# EAGLE schematic ASIC_card (EAGLE 6.3)

## Sheet 1 of 4: Data and clock
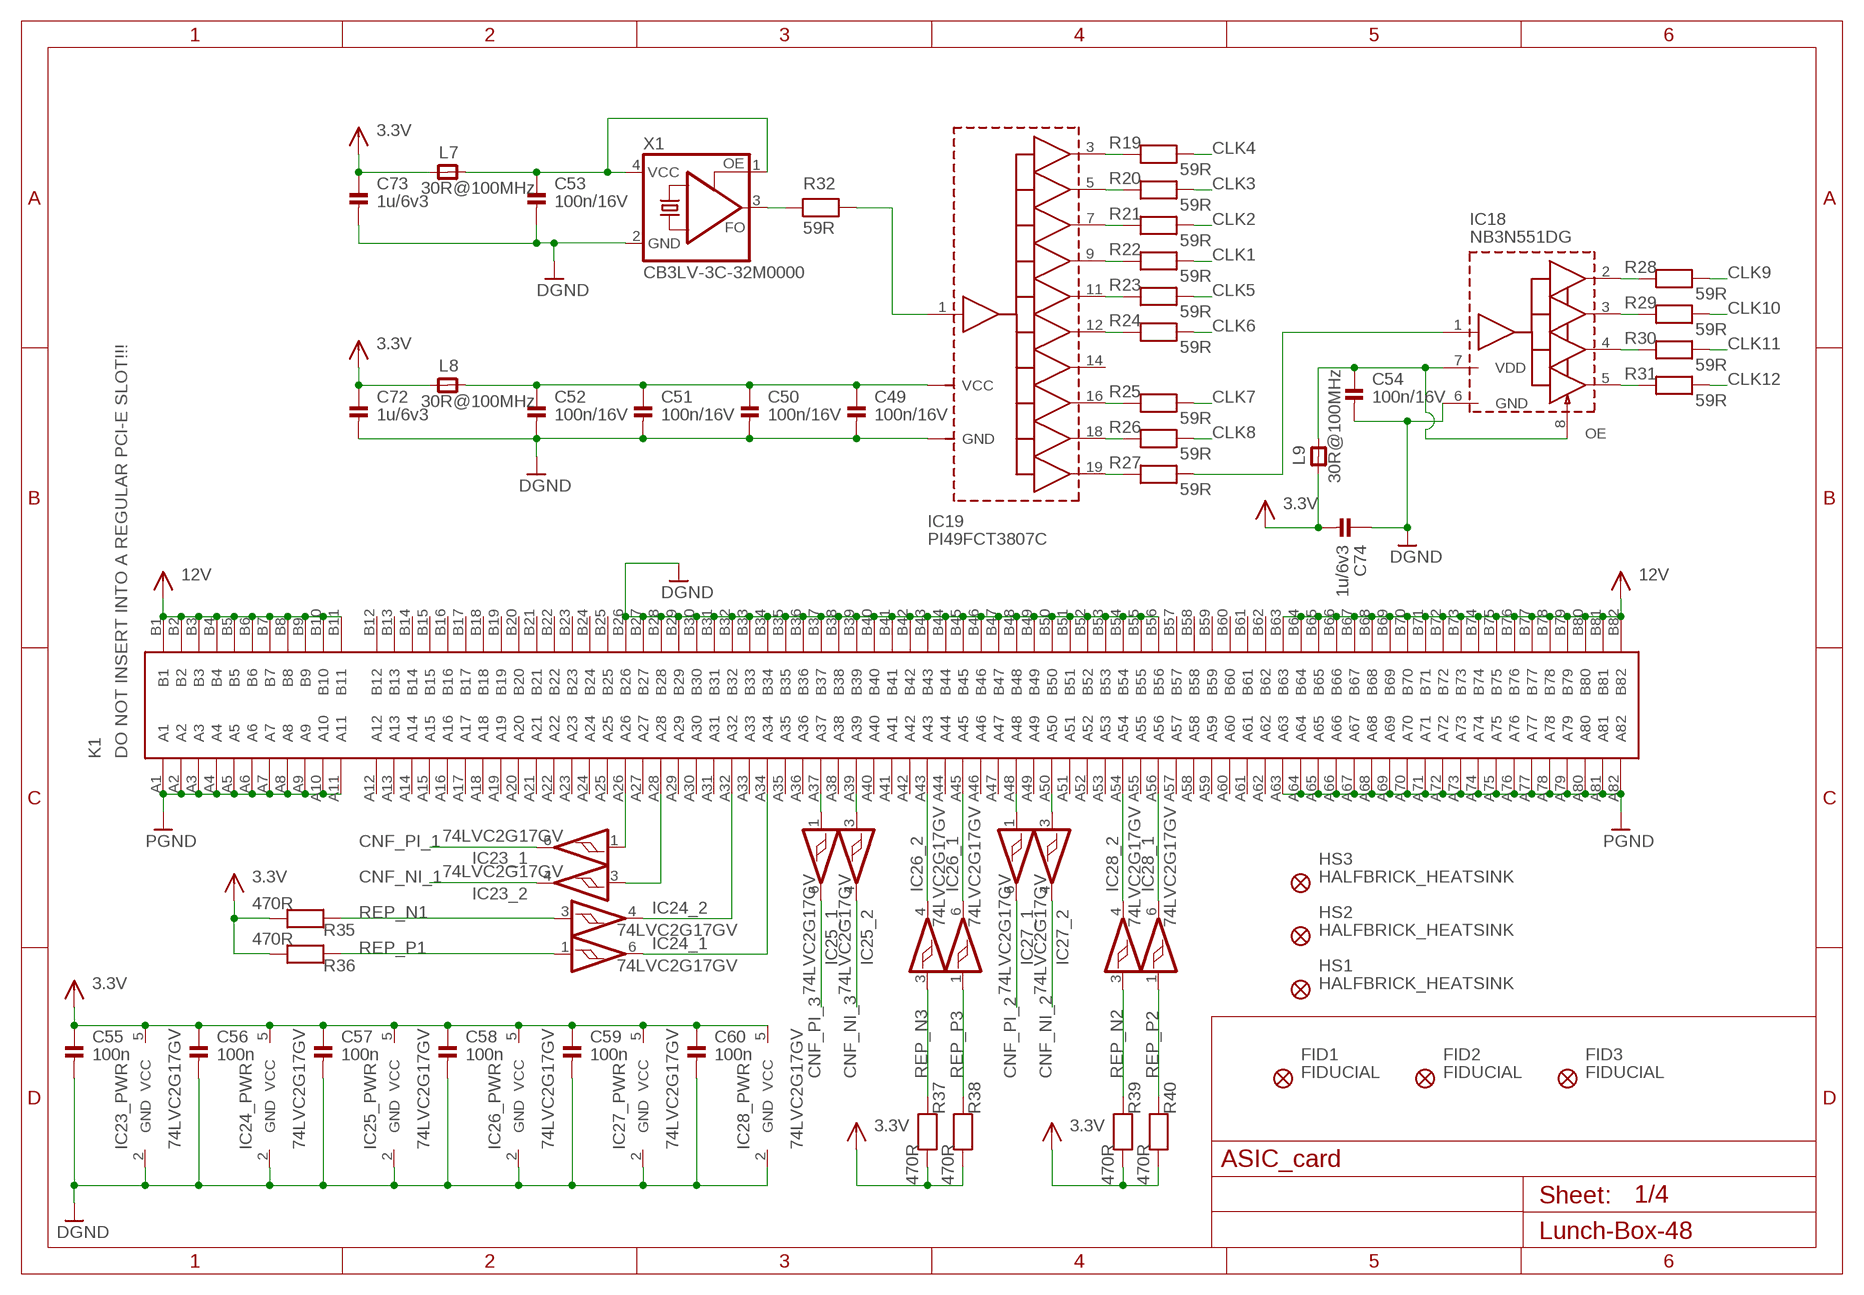
[diagram p0: schematic, sheet 1]

### Parts
C49  100n/16V  C0402  [0402]
C50  100n/16V  C0402  [0402]
C51  100n/16V  C0402  [0402]
C52  100n/16V  C0402  [0402]
C53  100n/16V  C0402  [0402]
C54  100n/16V  C0402  [0402]
C55  100n  C0603  [0603]
C56  100n  C0603  [0603]
C57  100n  C0603  [0603]
C58  100n  C0603  [0603]
C59  100n  C0603  [0603]
C60  100n  C0603  [0603]
C72  1u/6v3  C0402  [0402]
C73  1u/6v3  C0402  [0402]
C74  1u/6v3  C0402  [0402]
FID1  FIDUCIAL  [FID_1X2,5]
FID2  FIDUCIAL  [FID_1X2,5]
FID3  FIDUCIAL  [FID_1X2,5]
HS1  HALFBRICK_HEATSINK  [1/2_BRICK_HEATSINK]
HS2  HALFBRICK_HEATSINK  [1/2_BRICK_HEATSINK]
HS3  HALFBRICK_HEATSINK  [1/2_BRICK_HEATSINK]
IC18  NB3N551DG  [SO-8]
IC19  PI49FCT3807C  [SSOP-20]
IC23  74LVC2G17GV  [SOT23-6]
IC24  74LVC2G17GV  [SOT23-6]
IC25  74LVC2G17GV  [SOT23-6]
IC26  74LVC2G17GV  [SOT23-6]
IC27  74LVC2G17GV  [SOT23-6]
IC28  74LVC2G17GV  [SOT23-6]
K1  DO NOT INSERT INTO A REGULAR PCI-E SLOT!!!  PCI-E_CARDEDGE  [PCI-E_16X]
L7  30R@100MHz  FERRITE0603  [0603]
L8  30R@100MHz  FERRITE0603  [0603]
L9  30R@100MHz  FERRITE0603  [0603]
R19  59R  R0402  [0402]
R20  59R  R0402  [0402]
R21  59R  R0402  [0402]
R22  59R  R0402  [0402]
R23  59R  R0402  [0402]
R24  59R  R0402  [0402]
R25  59R  R0402  [0402]
R26  59R  R0402  [0402]
R27  59R  R0402  [0402]
R28  59R  R0402  [0402]
R29  59R  R0402  [0402]
R30  59R  R0402  [0402]
R31  59R  R0402  [0402]
R32  59R  R0402  [0402]
R35  470R  R0603  [0603]
R36  470R  R0603  [0603]
R37  470R  R0603  [0603]
R38  470R  R0603  [0603]
R39  470R  R0603  [0603]
R40  470R  R0603  [0603]
X1  CB3LV-3C-32M0000  [7X5_OSC]

### Nets
3.3V: C55.1 C56.1 C57.1 C58.1 C59.1 C60.1 C72.1 C73.1 C74.2 IC23.5(_PWR:VCC) IC24.5(_PWR:VCC) IC25.5(_PWR:VCC) IC26.5(_PWR:VCC) IC27.5(_PWR:VCC) IC28.5(_PWR:VCC) L7.1 L8.1 L9.1 R35.1 R36.1 R37.1 R38.1 R39.1 R40.1 ; also sheet 2,3,4
12V: K1.B1 K1.B2 K1.B3 K1.B4 K1.B5 K1.B6 K1.B7 K1.B8 K1.B9 K1.B10 K1.B11 K1.B63 K1.B64 K1.B65 K1.B66 K1.B67 K1.B68 K1.B69 K1.B70 K1.B71 K1.B72 K1.B73 K1.B74 K1.B75 K1.B76 K1.B77 K1.B78 K1.B79 K1.B80 K1.B81 K1.B82 ; also sheet 2
CLK1: R22.2 ; also sheet 3
CLK2: R21.2 ; also sheet 3
CLK3: R20.2 ; also sheet 3
CLK4: R19.2 ; also sheet 3
CLK5: R23.2 ; also sheet 3
CLK6: R24.2 ; also sheet 3
CLK7: R25.2 ; also sheet 3
CLK8: R26.2 ; also sheet 3
CLK9: R28.2 ; also sheet 3
CLK10: R29.2 ; also sheet 3
CLK11: R30.2 ; also sheet 3
CLK12: R31.2 ; also sheet 3
CNF_NI_1: IC23.4(_2:O) ; also sheet 3
CNF_NI_2: IC27.4(_2:O) ; also sheet 3
CNF_NI_3: IC25.4(_2:O) ; also sheet 3
CNF_PI_1: IC23.6(_1:O) ; also sheet 3
CNF_PI_2: IC27.6(_1:O) ; also sheet 3
CNF_PI_3: IC25.6(_1:O) ; also sheet 3
DGND: C49.2 C50.2 C51.2 C52.2 C53.2 C54.2 C55.2 C56.2 C57.2 C58.2 C59.2 C60.2 C72.2 C73.2 C74.1 IC18.6(GND) IC19.2(GND) IC19.6(GND) IC19.10(GND) IC19.13(GND) IC19.17(GND) IC23.2(_PWR:GND) IC24.2(_PWR:GND) IC25.2(_PWR:GND) IC26.2(_PWR:GND) IC27.2(_PWR:GND) IC28.2(_PWR:GND) K1.B26 K1.B27 K1.B28 K1.B29 K1.B30 K1.B31 K1.B32 K1.B33 K1.B34 K1.B35 K1.B36 K1.B37 K1.B38 K1.B39 K1.B40 K1.B41 K1.B42 K1.B43 K1.B44 K1.B45 K1.B46 K1.B47 K1.B48 K1.B49 K1.B50 K1.B51 K1.B52 K1.B53 K1.B54 K1.B55 K1.B56 X1.2(GND) ; also sheet 2,3,4
N$49: IC23.1(_1:I) K1.A26
N$50: IC23.3(_2:I) K1.A28
N$51: IC19.18(B8) R26.1
N$52: IC19.19(B9) R27.1
N$53: IC19.16(B7) R25.1
N$54: IC19.12(B5) R24.1
N$55: IC19.11(B4) R23.1
N$56: IC19.9(B3) R22.1
N$57: IC19.7(B2) R21.1
N$58: IC19.5(B1) R20.1
N$59: IC19.3(B0) R19.1
N$60: IC18.2(Q1) R28.1
N$61: IC18.3(Q2) R29.1
N$62: IC18.4(Q3) R30.1
N$63: IC18.5(Q4) R31.1
N$65: IC24.4(_2:O) K1.A32
N$66: IC24.6(_1:O) K1.A34
N$67: IC26.6(_1:O) K1.A45
N$68: R32.1 X1.3(FO)
N$69: IC19.1(A) R32.2
N$70: IC26.4(_2:O) K1.A43
N$71: IC28.4(_2:O) K1.A54
N$72: IC28.6(_1:O) K1.A56
N$73: IC27.1(_1:I) K1.A48
N$74: IC27.3(_2:I) K1.A50
N$75: C53.1 L7.2 X1.1(OE) X1.4(VCC)
N$76: C54.1 IC18.7(VDD) IC18.8(OE) L9.2
N$77: C49.1 C50.1 C51.1 C52.1 IC19.4(VCC) IC19.8(VCC) IC19.15(VCC) IC19.20(VCC) L8.2
N$78: IC18.1(CLK) R27.2
N$79: IC25.1(_1:I) K1.A37
N$80: IC25.3(_2:I) K1.A39
PGND: K1.A1 K1.A2 K1.A3 K1.A4 K1.A5 K1.A6 K1.A7 K1.A8 K1.A9 K1.A10 K1.A11 K1.A63 K1.A64 K1.A65 K1.A66 K1.A67 K1.A68 K1.A69 K1.A70 K1.A71 K1.A72 K1.A73 K1.A74 K1.A75 K1.A76 K1.A77 K1.A78 K1.A79 K1.A80 K1.A81 K1.A82 ; also sheet 2,3,4
REP_N1: IC24.3(_2:I) R35.2 ; also sheet 3
REP_N2: IC28.3(_2:I) R39.2 ; also sheet 3
REP_N3: IC26.3(_2:I) R37.2 ; also sheet 3
REP_P1: IC24.1(_1:I) R36.2 ; also sheet 3
REP_P2: IC28.1(_1:I) R40.2 ; also sheet 3
REP_P3: IC26.1(_1:I) R38.2 ; also sheet 3
Unconnected: IC19.14(B6) K1.A12 K1.A13 K1.A14 K1.A15 K1.A16 K1.A17 K1.A18 K1.A19 K1.A20 K1.A21 K1.A22 K1.A23 K1.A24 K1.A25 K1.A27 K1.A29 K1.A30 K1.A31 K1.A33 K1.A35 K1.A36 K1.A38 K1.A40 K1.A41 K1.A42 K1.A44 K1.A46 K1.A47 K1.A49 K1.A51 K1.A52 K1.A53 K1.A55 K1.A57 K1.A58 K1.A59 K1.A60 K1.A61 K1.A62 K1.B12 K1.B13 K1.B14 K1.B15 K1.B16 K1.B17 K1.B18 K1.B19 K1.B20 K1.B21 K1.B22 K1.B23 K1.B24 K1.B25 K1.B57 K1.B58 K1.B59 K1.B60 K1.B61 K1.B62

## Sheet 2 of 4: Powersuplies
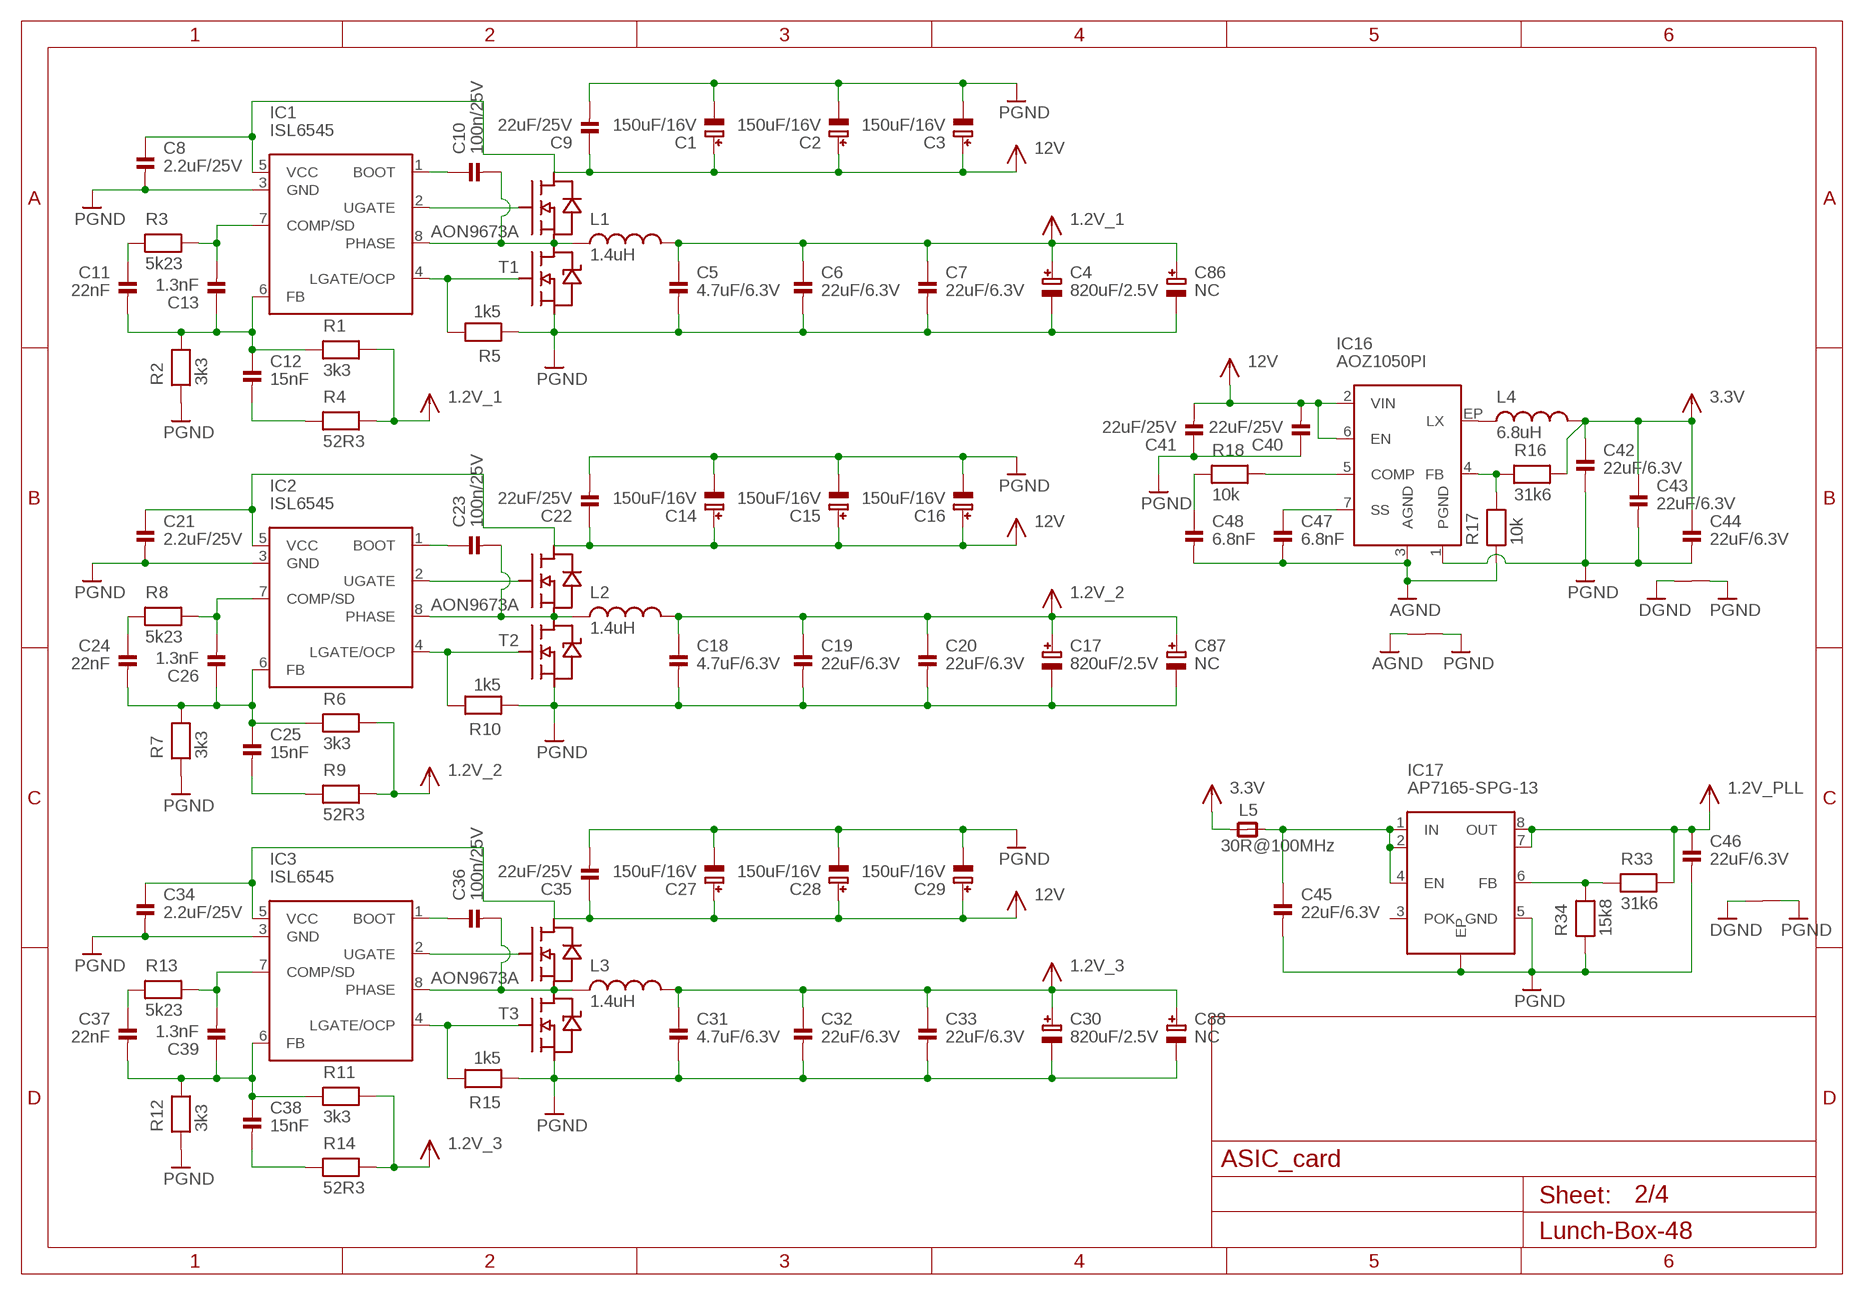
[diagram p1: schematic, sheet 2]

### Parts
C1  150uF/16V  C_POL  [CAP_POL_8MM]
C2  150uF/16V  C_POL  [CAP_POL_8MM]
C3  150uF/16V  C_POL  [CAP_POL_8MM]
C4  820uF/2.5V  C_POL  [CAP_POL_8MM]
C5  4.7uF/6.3V  C0306  [0306]
C6  22uF/6.3V  C0805  [0805]
C7  22uF/6.3V  C0805  [0805]
C8  2.2uF/25V  C0603  [0603]
C9  22uF/25V  C1210  [1210]
C10  100n/25V  C0603  [0603]
C11  22nF  C0603  [0603]
C12  15nF  C0603  [0603]
C13  1.3nF  C0603  [0603]
C14  150uF/16V  C_POL  [CAP_POL_8MM]
C15  150uF/16V  C_POL  [CAP_POL_8MM]
C16  150uF/16V  C_POL  [CAP_POL_8MM]
C17  820uF/2.5V  C_POL  [CAP_POL_8MM]
C18  4.7uF/6.3V  C0306  [0306]
C19  22uF/6.3V  C0805  [0805]
C20  22uF/6.3V  C0805  [0805]
C21  2.2uF/25V  C0603  [0603]
C22  22uF/25V  C1210  [1210]
C23  100n/25V  C0603  [0603]
C24  22nF  C0603  [0603]
C25  15nF  C0603  [0603]
C26  1.3nF  C0603  [0603]
C27  150uF/16V  C_POL  [CAP_POL_8MM]
C28  150uF/16V  C_POL  [CAP_POL_8MM]
C29  150uF/16V  C_POL  [CAP_POL_8MM]
C30  820uF/2.5V  C_POL  [CAP_POL_8MM]
C31  4.7uF/6.3V  C0306  [0306]
C32  22uF/6.3V  C0805  [0805]
C33  22uF/6.3V  C0805  [0805]
C34  2.2uF/25V  C0603  [0603]
C35  22uF/25V  C1210  [1210]
C36  100n/25V  C0603  [0603]
C37  22nF  C0603  [0603]
C38  15nF  C0603  [0603]
C39  1.3nF  C0603  [0603]
C40  22uF/25V  C1210  [1210]
C41  22uF/25V  C1210  [1210]
C42  22uF/6.3V  C0805  [0805]
C43  22uF/6.3V  C0805  [0805]
C44  22uF/6.3V  C0805  [0805]
C45  22uF/6.3V  C0805  [0805]
C46  22uF/6.3V  C0805  [0805]
C47  6.8nF  C0603  [0603]
C48  6.8nF  C0603  [0603]
C86  NC  C_POL  [CAP_POL_8MM]
C87  NC  C_POL  [CAP_POL_8MM]
C88  NC  C_POL  [CAP_POL_8MM]
IC1  ISL6545  [SO-8_BIGPADS]
IC2  ISL6545  [SO-8_BIGPADS]
IC3  ISL6545  [SO-8_BIGPADS]
IC16  AOZ1050PI  [SO-8_EP]
IC17  AP7165-SPG-13  [SO-8_EP]
L1  1.4uH  B82559A0142A013  [B82559A0142A013]
L2  1.4uH  B82559A0142A013  [B82559A0142A013]
L3  1.4uH  B82559A0142A013  [B82559A0142A013]
L4  6.8uH  SRU1048-6R8Y  [SRU1048-6R8Y]
L5  30R@100MHz  FERRITE0603  [0603]
R1  3k3  R0603  [0603]
R2  3k3  R0603  [0603]
R3  5k23  R0603  [0603]
R4  52R3  R0603  [0603]
R5  1k5  R0603  [0603]
R6  3k3  R0603  [0603]
R7  3k3  R0603  [0603]
R8  5k23  R0603  [0603]
R9  52R3  R0603  [0603]
R10  1k5  R0603  [0603]
R11  3k3  R0603  [0603]
R12  3k3  R0603  [0603]
R13  5k23  R0603  [0603]
R14  52R3  R0603  [0603]
R15  1k5  R0603  [0603]
R16  31k6  R0603  [0603]
R17  10k  R0603  [0603]
R18  10k  R0603  [0603]
R33  31k6  R0603  [0603]
R34  15k8  R0603  [0603]
T1  AON9673A  [DFN5X6]
T2  AON9673A  [DFN5X6]
T3  AON9673A  [DFN5X6]
VIA1  VIA  [VIA]
VIA2  VIA  [VIA]
VIA3  VIA  [VIA]

### Nets
1.2V_1: C4.P$1(+) C5.1 C6.1 C7.1 C86.P$1(+) L1.2 R1.2 R4.2 ; also sheet 3,4
1.2V_2: C17.P$1(+) C18.1 C19.1 C20.1 C87.P$1(+) L2.2 R6.2 R9.2 ; also sheet 3,4
1.2V_3: C30.P$1(+) C31.1 C32.1 C33.1 C88.P$1(+) L3.2 R11.2 R14.2 ; also sheet 3,4
1.2V_PLL: C46.1 IC17.7(OUT1) IC17.8(OUT) R33.2 ; also sheet 4
3.3V: C42.1 C43.1 C44.1 L4.2 L5.1 R16.2 ; also sheet 1,3,4
12V: C1.P$1(+) C2.P$1(+) C3.P$1(+) C8.1 C9.1 C14.P$1(+) C15.P$1(+) C16.P$1(+) C21.1 C22.1 C27.P$1(+) C28.P$1(+) C29.P$1(+) C34.1 C35.1 C40.2 C41.2 IC1.5(VCC) IC2.5(VCC) IC3.5(VCC) IC16.2(VIN) IC16.6(EN) T1.D1 T2.D1 T3.D1 ; also sheet 1
AGND: C47.2 C48.2 IC16.3(AGND) R17.1 VIA1.P$1
DGND: VIA2.P$1 VIA3.P$1 ; also sheet 1,3,4
N$7: C12.2 R4.1
N$8: IC1.2(UGATE) T1.1(G1)
N$9: IC1.4(LGATE/OCP) R5.2 T1.8(G2)
N$10: C10.1 IC1.1(BOOT)
N$11: C13.2 IC1.7(COMP/SD) R3.2
N$12: C11.1 R3.1
N$15: C11.2 C12.1 C13.1 IC1.6(FB) R1.1 R2.2
N$26: C10.2 IC1.8(PHASE) L1.1 T1.S1_D2
N$27: IC3.2(UGATE) T3.1(G1)
N$28: IC2.2(UGATE) T2.1(G1)
N$29: IC2.4(LGATE/OCP) R10.2 T2.8(G2)
N$30: C23.2 IC2.8(PHASE) L2.1 T2.S1_D2
N$31: C23.1 IC2.1(BOOT)
N$32: C26.2 IC2.7(COMP/SD) R8.2
N$33: C24.1 R8.1
N$34: C24.2 C25.1 C26.1 IC2.6(FB) R6.1 R7.2
N$35: C25.2 R9.1
N$36: IC3.4(LGATE/OCP) R15.2 T3.8(G2)
N$37: C36.2 IC3.8(PHASE) L3.1 T3.S1_D2
N$38: C36.1 IC3.1(BOOT)
N$39: C39.2 IC3.7(COMP/SD) R13.2
N$40: C37.1 R13.1
N$41: C37.2 C38.1 C39.1 IC3.6(FB) R11.1 R12.2
N$42: C38.2 R14.1
N$43: C47.1 IC16.7(SS)
N$44: C45.1 IC17.1(IN) IC17.2(IN1) IC17.4(EN) L5.2
N$45: C48.1 R18.1
N$46: IC16.5(COMP) R18.2
N$47: IC16.4(FB) R16.1 R17.2
N$48: IC16.EP(LX) L4.1
N$64: IC17.6(FB) R33.1 R34.2
PGND: C1.P$2(-) C2.P$2(-) C3.P$2(-) C4.P$2(-) C5.2 C6.2 C7.2 C8.2 C9.2 C14.P$2(-) C15.P$2(-) C16.P$2(-) C17.P$2(-) C18.2 C19.2 C20.2 C21.2 C22.2 C27.P$2(-) C28.P$2(-) C29.P$2(-) C30.P$2(-) C31.2 C32.2 C33.2 C34.2 C35.2 C40.1 C41.1 C42.2 C43.2 C44.2 C45.2 C46.2 C86.P$2(-) C87.P$2(-) C88.P$2(-) IC1.3(GND) IC2.3(GND) IC3.3(GND) IC16.1(PGND) IC17.5(GND) IC17.EP R2.1 R5.1 R7.1 R10.1 R12.1 R15.1 R34.1 T1.5(S2) T1.6(S2) T1.7(S2) T2.5(S2) T2.6(S2) T2.7(S2) T3.5(S2) T3.6(S2) T3.7(S2) VIA1.P$2 VIA2.P$2 VIA3.P$2 ; also sheet 1,3,4
Unconnected: IC17.3(POK)

## Sheet 3 of 4: ASICs
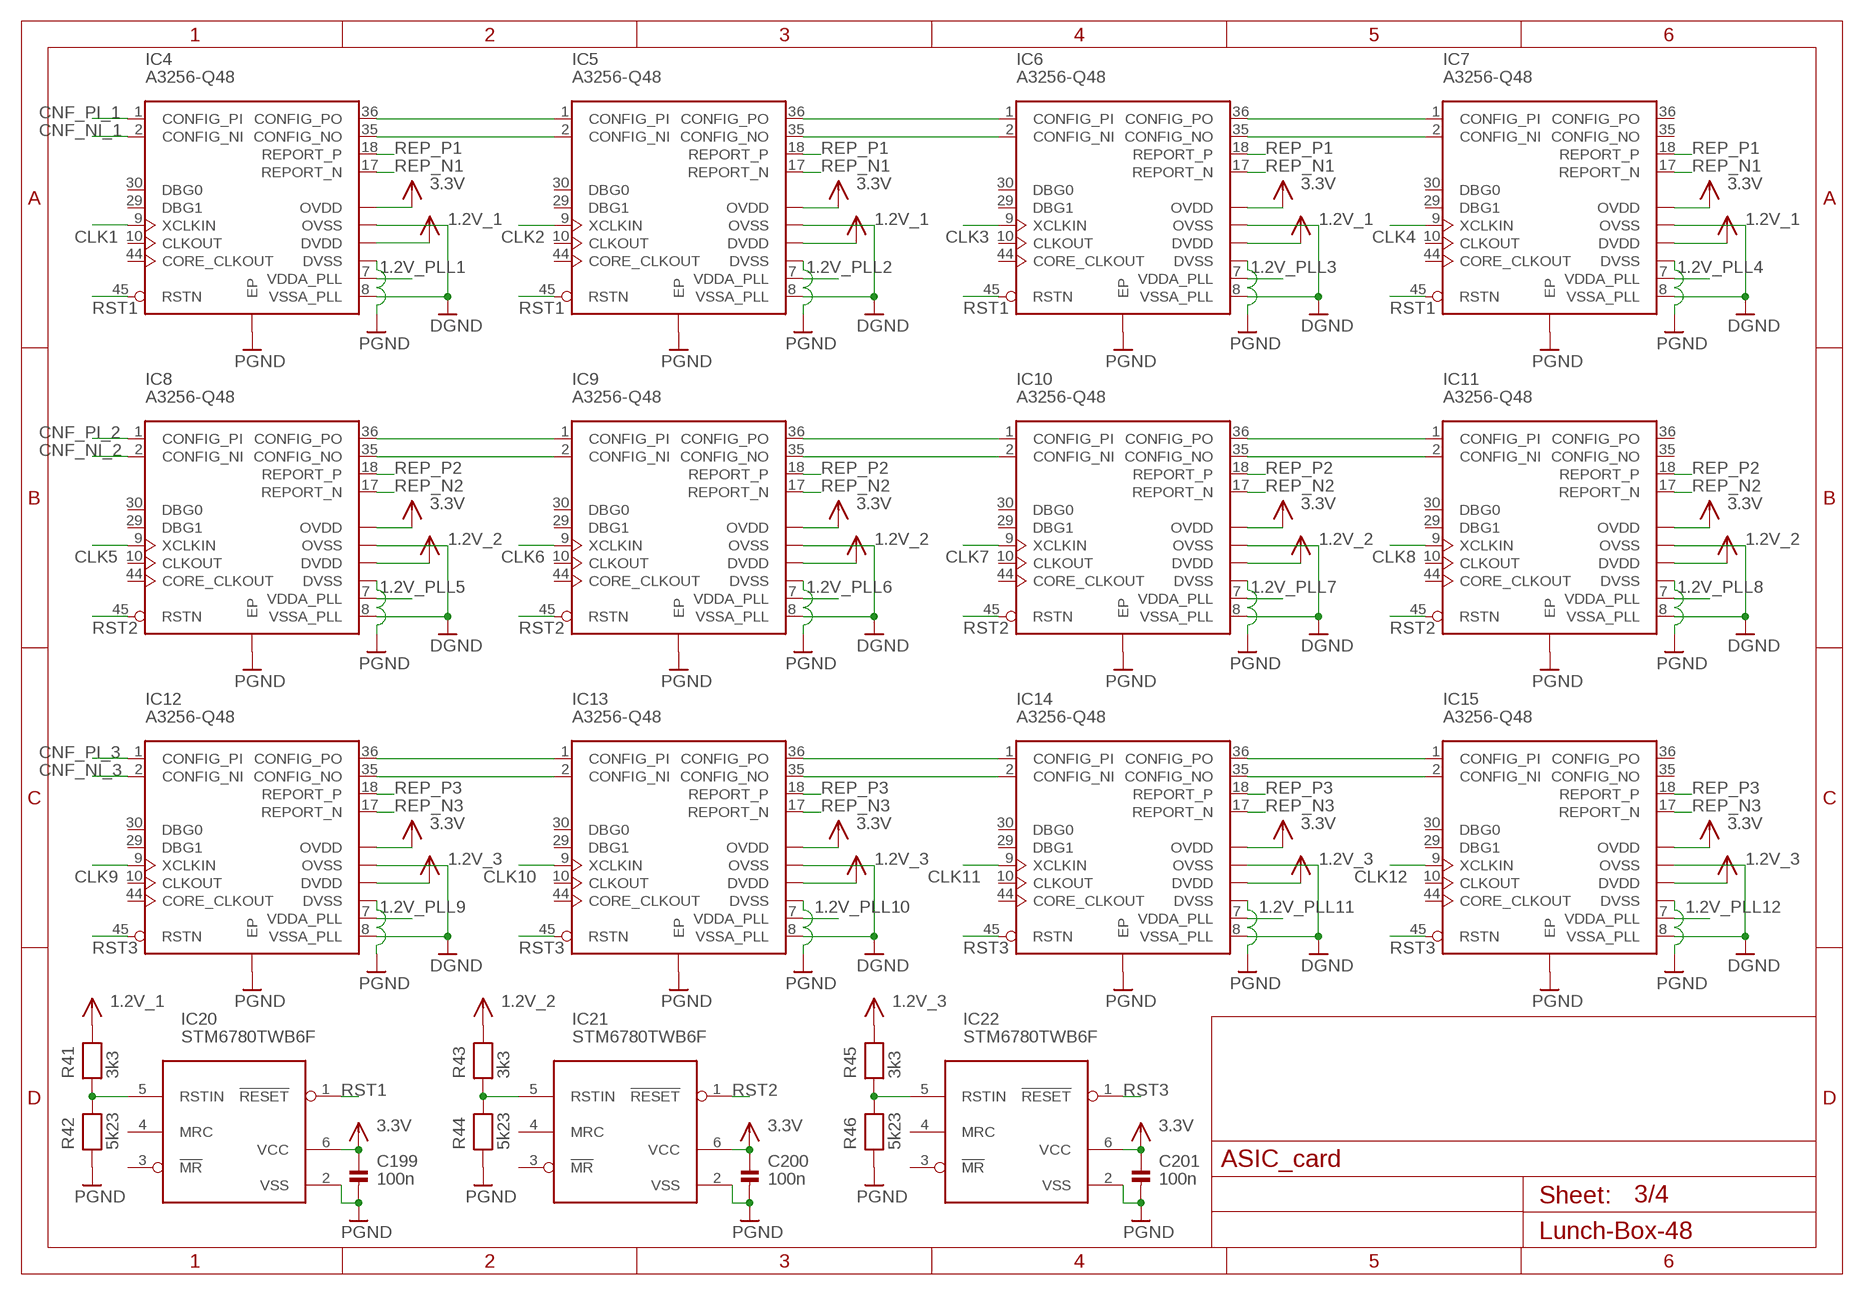
[diagram p2: schematic, sheet 3]

### Parts
C199  100n  C0603  [0603]
C200  100n  C0603  [0603]
C201  100n  C0603  [0603]
IC4  A3256-Q48  [QFN48_EP]
IC5  A3256-Q48  [QFN48_EP]
IC6  A3256-Q48  [QFN48_EP]
IC7  A3256-Q48  [QFN48_EP]
IC8  A3256-Q48  [QFN48_EP]
IC9  A3256-Q48  [QFN48_EP]
IC10  A3256-Q48  [QFN48_EP]
IC11  A3256-Q48  [QFN48_EP]
IC12  A3256-Q48  [QFN48_EP]
IC13  A3256-Q48  [QFN48_EP]
IC14  A3256-Q48  [QFN48_EP]
IC15  A3256-Q48  [QFN48_EP]
IC20  STM6780TWB6F  [SOT23-6]
IC21  STM6780TWB6F  [SOT23-6]
IC22  STM6780TWB6F  [SOT23-6]
R41  3k3  R0603  [0603]
R42  5k23  R0603  [0603]
R43  3k3  R0603  [0603]
R44  5k23  R0603  [0603]
R45  3k3  R0603  [0603]
R46  5k23  R0603  [0603]

### Nets
1.2V_1: IC4.3(DVDD) IC4.4(DVDD) IC4.6(DVDD) IC4.11(DVDD) IC4.12(DVDD) IC4.13(DVDD) IC4.14(DVDD) IC4.15(DVDD) IC4.16(DVDD) IC4.19(DVDD) IC4.21(DVDD) IC4.22(DVDD) IC4.25(DVDD) IC4.26(DVDD) IC4.27(DVDD) IC4.28(DVDD) IC4.31(DVDD) IC4.33(DVDD) IC4.34(DVDD) IC4.39(DVDD) IC4.40(DVDD) IC4.41(DVDD) IC4.43(DVDD) IC4.46(DVDD) IC4.47(DVDD) IC4.48(DVDD) IC5.3(DVDD) IC5.4(DVDD) IC5.6(DVDD) IC5.11(DVDD) IC5.12(DVDD) IC5.13(DVDD) IC5.14(DVDD) IC5.15(DVDD) IC5.16(DVDD) IC5.19(DVDD) IC5.21(DVDD) IC5.22(DVDD) IC5.25(DVDD) IC5.26(DVDD) IC5.27(DVDD) IC5.28(DVDD) IC5.31(DVDD) IC5.33(DVDD) IC5.34(DVDD) IC5.39(DVDD) IC5.40(DVDD) IC5.41(DVDD) IC5.43(DVDD) IC5.46(DVDD) IC5.47(DVDD) IC5.48(DVDD) IC6.3(DVDD) IC6.4(DVDD) IC6.6(DVDD) IC6.11(DVDD) IC6.12(DVDD) IC6.13(DVDD) IC6.14(DVDD) IC6.15(DVDD) IC6.16(DVDD) IC6.19(DVDD) IC6.21(DVDD) IC6.22(DVDD) IC6.25(DVDD) IC6.26(DVDD) IC6.27(DVDD) IC6.28(DVDD) IC6.31(DVDD) IC6.33(DVDD) IC6.34(DVDD) IC6.39(DVDD) IC6.40(DVDD) IC6.41(DVDD) IC6.43(DVDD) IC6.46(DVDD) IC6.47(DVDD) IC6.48(DVDD) IC7.3(DVDD) IC7.4(DVDD) IC7.6(DVDD) IC7.11(DVDD) IC7.12(DVDD) IC7.13(DVDD) IC7.14(DVDD) IC7.15(DVDD) IC7.16(DVDD) IC7.19(DVDD) IC7.21(DVDD) IC7.22(DVDD) IC7.25(DVDD) IC7.26(DVDD) IC7.27(DVDD) IC7.28(DVDD) IC7.31(DVDD) IC7.33(DVDD) IC7.34(DVDD) IC7.39(DVDD) IC7.40(DVDD) IC7.41(DVDD) IC7.43(DVDD) IC7.46(DVDD) IC7.47(DVDD) IC7.48(DVDD) R41.2 ; also sheet 2,4
1.2V_2: IC8.3(DVDD) IC8.4(DVDD) IC8.6(DVDD) IC8.11(DVDD) IC8.12(DVDD) IC8.13(DVDD) IC8.14(DVDD) IC8.15(DVDD) IC8.16(DVDD) IC8.19(DVDD) IC8.21(DVDD) IC8.22(DVDD) IC8.25(DVDD) IC8.26(DVDD) IC8.27(DVDD) IC8.28(DVDD) IC8.31(DVDD) IC8.33(DVDD) IC8.34(DVDD) IC8.39(DVDD) IC8.40(DVDD) IC8.41(DVDD) IC8.43(DVDD) IC8.46(DVDD) IC8.47(DVDD) IC8.48(DVDD) IC9.3(DVDD) IC9.4(DVDD) IC9.6(DVDD) IC9.11(DVDD) IC9.12(DVDD) IC9.13(DVDD) IC9.14(DVDD) IC9.15(DVDD) IC9.16(DVDD) IC9.19(DVDD) IC9.21(DVDD) IC9.22(DVDD) IC9.25(DVDD) IC9.26(DVDD) IC9.27(DVDD) IC9.28(DVDD) IC9.31(DVDD) IC9.33(DVDD) IC9.34(DVDD) IC9.39(DVDD) IC9.40(DVDD) IC9.41(DVDD) IC9.43(DVDD) IC9.46(DVDD) IC9.47(DVDD) IC9.48(DVDD) IC10.3(DVDD) IC10.4(DVDD) IC10.6(DVDD) IC10.11(DVDD) IC10.12(DVDD) IC10.13(DVDD) IC10.14(DVDD) IC10.15(DVDD) IC10.16(DVDD) IC10.19(DVDD) IC10.21(DVDD) IC10.22(DVDD) IC10.25(DVDD) IC10.26(DVDD) IC10.27(DVDD) IC10.28(DVDD) IC10.31(DVDD) IC10.33(DVDD) IC10.34(DVDD) IC10.39(DVDD) IC10.40(DVDD) IC10.41(DVDD) IC10.43(DVDD) IC10.46(DVDD) IC10.47(DVDD) IC10.48(DVDD) IC11.3(DVDD) IC11.4(DVDD) IC11.6(DVDD) IC11.11(DVDD) IC11.12(DVDD) IC11.13(DVDD) IC11.14(DVDD) IC11.15(DVDD) IC11.16(DVDD) IC11.19(DVDD) IC11.21(DVDD) IC11.22(DVDD) IC11.25(DVDD) IC11.26(DVDD) IC11.27(DVDD) IC11.28(DVDD) IC11.31(DVDD) IC11.33(DVDD) IC11.34(DVDD) IC11.39(DVDD) IC11.40(DVDD) IC11.41(DVDD) IC11.43(DVDD) IC11.46(DVDD) IC11.47(DVDD) IC11.48(DVDD) R43.2 ; also sheet 2,4
1.2V_3: IC12.3(DVDD) IC12.4(DVDD) IC12.6(DVDD) IC12.11(DVDD) IC12.12(DVDD) IC12.13(DVDD) IC12.14(DVDD) IC12.15(DVDD) IC12.16(DVDD) IC12.19(DVDD) IC12.21(DVDD) IC12.22(DVDD) IC12.25(DVDD) IC12.26(DVDD) IC12.27(DVDD) IC12.28(DVDD) IC12.31(DVDD) IC12.33(DVDD) IC12.34(DVDD) IC12.39(DVDD) IC12.40(DVDD) IC12.41(DVDD) IC12.43(DVDD) IC12.46(DVDD) IC12.47(DVDD) IC12.48(DVDD) IC13.3(DVDD) IC13.4(DVDD) IC13.6(DVDD) IC13.11(DVDD) IC13.12(DVDD) IC13.13(DVDD) IC13.14(DVDD) IC13.15(DVDD) IC13.16(DVDD) IC13.19(DVDD) IC13.21(DVDD) IC13.22(DVDD) IC13.25(DVDD) IC13.26(DVDD) IC13.27(DVDD) IC13.28(DVDD) IC13.31(DVDD) IC13.33(DVDD) IC13.34(DVDD) IC13.39(DVDD) IC13.40(DVDD) IC13.41(DVDD) IC13.43(DVDD) IC13.46(DVDD) IC13.47(DVDD) IC13.48(DVDD) IC14.3(DVDD) IC14.4(DVDD) IC14.6(DVDD) IC14.11(DVDD) IC14.12(DVDD) IC14.13(DVDD) IC14.14(DVDD) IC14.15(DVDD) IC14.16(DVDD) IC14.19(DVDD) IC14.21(DVDD) IC14.22(DVDD) IC14.25(DVDD) IC14.26(DVDD) IC14.27(DVDD) IC14.28(DVDD) IC14.31(DVDD) IC14.33(DVDD) IC14.34(DVDD) IC14.39(DVDD) IC14.40(DVDD) IC14.41(DVDD) IC14.43(DVDD) IC14.46(DVDD) IC14.47(DVDD) IC14.48(DVDD) IC15.3(DVDD) IC15.4(DVDD) IC15.6(DVDD) IC15.11(DVDD) IC15.12(DVDD) IC15.13(DVDD) IC15.14(DVDD) IC15.15(DVDD) IC15.16(DVDD) IC15.19(DVDD) IC15.21(DVDD) IC15.22(DVDD) IC15.25(DVDD) IC15.26(DVDD) IC15.27(DVDD) IC15.28(DVDD) IC15.31(DVDD) IC15.33(DVDD) IC15.34(DVDD) IC15.39(DVDD) IC15.40(DVDD) IC15.41(DVDD) IC15.43(DVDD) IC15.46(DVDD) IC15.47(DVDD) IC15.48(DVDD) R45.2 ; also sheet 2,4
1.2V_PLL1: IC4.7(VDDA_PLL) ; also sheet 4
1.2V_PLL2: IC5.7(VDDA_PLL) ; also sheet 4
1.2V_PLL3: IC6.7(VDDA_PLL) ; also sheet 4
1.2V_PLL4: IC7.7(VDDA_PLL) ; also sheet 4
1.2V_PLL5: IC8.7(VDDA_PLL) ; also sheet 4
1.2V_PLL6: IC9.7(VDDA_PLL) ; also sheet 4
1.2V_PLL7: IC10.7(VDDA_PLL) ; also sheet 4
1.2V_PLL8: IC11.7(VDDA_PLL) ; also sheet 4
1.2V_PLL9: IC12.7(VDDA_PLL) ; also sheet 4
1.2V_PLL10: IC13.7(VDDA_PLL) ; also sheet 4
1.2V_PLL11: IC14.7(VDDA_PLL) ; also sheet 4
1.2V_PLL12: IC15.7(VDDA_PLL) ; also sheet 4
3.3V: C199.1 C200.1 C201.1 IC4.24(OVDD) IC4.37(OVDD) IC5.24(OVDD) IC5.37(OVDD) IC6.24(OVDD) IC6.37(OVDD) IC7.24(OVDD) IC7.37(OVDD) IC8.24(OVDD) IC8.37(OVDD) IC9.24(OVDD) IC9.37(OVDD) IC10.24(OVDD) IC10.37(OVDD) IC11.24(OVDD) IC11.37(OVDD) IC12.24(OVDD) IC12.37(OVDD) IC13.24(OVDD) IC13.37(OVDD) IC14.24(OVDD) IC14.37(OVDD) IC15.24(OVDD) IC15.37(OVDD) IC20.6(VCC) IC21.6(VCC) IC22.6(VCC) ; also sheet 1,2,4
CLK1: IC4.9(XCLKIN) ; also sheet 1
CLK2: IC5.9(XCLKIN) ; also sheet 1
CLK3: IC6.9(XCLKIN) ; also sheet 1
CLK4: IC7.9(XCLKIN) ; also sheet 1
CLK5: IC8.9(XCLKIN) ; also sheet 1
CLK6: IC9.9(XCLKIN) ; also sheet 1
CLK7: IC10.9(XCLKIN) ; also sheet 1
CLK8: IC11.9(XCLKIN) ; also sheet 1
CLK9: IC12.9(XCLKIN) ; also sheet 1
CLK10: IC13.9(XCLKIN) ; also sheet 1
CLK11: IC14.9(XCLKIN) ; also sheet 1
CLK12: IC15.9(XCLKIN) ; also sheet 1
CNF_NI_1: IC4.2(CONFIG_NI) ; also sheet 1
CNF_NI_2: IC8.2(CONFIG_NI) ; also sheet 1
CNF_NI_3: IC12.2(CONFIG_NI) ; also sheet 1
CNF_PI_1: IC4.1(CONFIG_PI) ; also sheet 1
CNF_PI_2: IC8.1(CONFIG_PI) ; also sheet 1
CNF_PI_3: IC12.1(CONFIG_PI) ; also sheet 1
DGND: IC4.8(VSSA_PLL) IC4.23(OVSS) IC4.38(OVSS) IC5.8(VSSA_PLL) IC5.23(OVSS) IC5.38(OVSS) IC6.8(VSSA_PLL) IC6.23(OVSS) IC6.38(OVSS) IC7.8(VSSA_PLL) IC7.23(OVSS) IC7.38(OVSS) IC8.8(VSSA_PLL) IC8.23(OVSS) IC8.38(OVSS) IC9.8(VSSA_PLL) IC9.23(OVSS) IC9.38(OVSS) IC10.8(VSSA_PLL) IC10.23(OVSS) IC10.38(OVSS) IC11.8(VSSA_PLL) IC11.23(OVSS) IC11.38(OVSS) IC12.8(VSSA_PLL) IC12.23(OVSS) IC12.38(OVSS) IC13.8(VSSA_PLL) IC13.23(OVSS) IC13.38(OVSS) IC14.8(VSSA_PLL) IC14.23(OVSS) IC14.38(OVSS) IC15.8(VSSA_PLL) IC15.23(OVSS) IC15.38(OVSS) ; also sheet 1,2,4
N$1: IC4.36(CONFIG_PO) IC5.1(CONFIG_PI)
N$2: IC4.35(CONFIG_NO) IC5.2(CONFIG_NI)
N$3: IC5.36(CONFIG_PO) IC6.1(CONFIG_PI)
N$4: IC5.35(CONFIG_NO) IC6.2(CONFIG_NI)
N$5: IC6.36(CONFIG_PO) IC7.1(CONFIG_PI)
N$6: IC6.35(CONFIG_NO) IC7.2(CONFIG_NI)
N$13: IC8.36(CONFIG_PO) IC9.1(CONFIG_PI)
N$14: IC8.35(CONFIG_NO) IC9.2(CONFIG_NI)
N$16: IC9.36(CONFIG_PO) IC10.1(CONFIG_PI)
N$17: IC9.35(CONFIG_NO) IC10.2(CONFIG_NI)
N$18: IC10.36(CONFIG_PO) IC11.1(CONFIG_PI)
N$19: IC10.35(CONFIG_NO) IC11.2(CONFIG_NI)
N$20: IC14.36(CONFIG_PO) IC15.1(CONFIG_PI)
N$21: IC14.35(CONFIG_NO) IC15.2(CONFIG_NI)
N$22: IC13.36(CONFIG_PO) IC14.1(CONFIG_PI)
N$23: IC13.35(CONFIG_NO) IC14.2(CONFIG_NI)
N$24: IC12.36(CONFIG_PO) IC13.1(CONFIG_PI)
N$25: IC12.35(CONFIG_NO) IC13.2(CONFIG_NI)
N$81: IC20.5(RSTIN) R41.1 R42.2
N$82: IC21.5(RSTIN) R43.1 R44.2
N$85: IC22.5(RSTIN) R45.1 R46.2
PGND: C199.2 C200.2 C201.2 IC4.5(DVSS) IC4.20(DVSS) IC4.32(DVSS) IC4.42(DVSS) IC4.EP IC5.5(DVSS) IC5.20(DVSS) IC5.32(DVSS) IC5.42(DVSS) IC5.EP IC6.5(DVSS) IC6.20(DVSS) IC6.32(DVSS) IC6.42(DVSS) IC6.EP IC7.5(DVSS) IC7.20(DVSS) IC7.32(DVSS) IC7.42(DVSS) IC7.EP IC8.5(DVSS) IC8.20(DVSS) IC8.32(DVSS) IC8.42(DVSS) IC8.EP IC9.5(DVSS) IC9.20(DVSS) IC9.32(DVSS) IC9.42(DVSS) IC9.EP IC10.5(DVSS) IC10.20(DVSS) IC10.32(DVSS) IC10.42(DVSS) IC10.EP IC11.5(DVSS) IC11.20(DVSS) IC11.32(DVSS) IC11.42(DVSS) IC11.EP IC12.5(DVSS) IC12.20(DVSS) IC12.32(DVSS) IC12.42(DVSS) IC12.EP IC13.5(DVSS) IC13.20(DVSS) IC13.32(DVSS) IC13.42(DVSS) IC13.EP IC14.5(DVSS) IC14.20(DVSS) IC14.32(DVSS) IC14.42(DVSS) IC14.EP IC15.5(DVSS) IC15.20(DVSS) IC15.32(DVSS) IC15.42(DVSS) IC15.EP IC20.2(VSS) IC21.2(VSS) IC22.2(VSS) R42.1 R44.1 R46.1 ; also sheet 1,2,4
REP_N1: IC4.17(REPORT_N) IC5.17(REPORT_N) IC6.17(REPORT_N) IC7.17(REPORT_N) ; also sheet 1
REP_N2: IC8.17(REPORT_N) IC9.17(REPORT_N) IC10.17(REPORT_N) IC11.17(REPORT_N) ; also sheet 1
REP_N3: IC12.17(REPORT_N) IC13.17(REPORT_N) IC14.17(REPORT_N) IC15.17(REPORT_N) ; also sheet 1
REP_P1: IC4.18(REPORT_P) IC5.18(REPORT_P) IC6.18(REPORT_P) IC7.18(REPORT_P) ; also sheet 1
REP_P2: IC8.18(REPORT_P) IC9.18(REPORT_P) IC10.18(REPORT_P) IC11.18(REPORT_P) ; also sheet 1
REP_P3: IC12.18(REPORT_P) IC13.18(REPORT_P) IC14.18(REPORT_P) IC15.18(REPORT_P) ; also sheet 1
RST1: IC4.45(RSTN) IC5.45(RSTN) IC6.45(RSTN) IC7.45(RSTN) IC20.1(!RESET!)
RST2: IC8.45(RSTN) IC9.45(RSTN) IC10.45(RSTN) IC11.45(RSTN) IC21.1(!RESET!)
RST3: IC12.45(RSTN) IC13.45(RSTN) IC14.45(RSTN) IC15.45(RSTN) IC22.1(!RESET!)
Unconnected: IC4.10(CLKOUT) IC4.29(DBG1) IC4.30(DBG0) IC4.44(CORE_CLKOUT) IC5.10(CLKOUT) IC5.29(DBG1) IC5.30(DBG0) IC5.44(CORE_CLKOUT) IC6.10(CLKOUT) IC6.29(DBG1) IC6.30(DBG0) IC6.44(CORE_CLKOUT) IC7.10(CLKOUT) IC7.29(DBG1) IC7.30(DBG0) IC7.35(CONFIG_NO) IC7.36(CONFIG_PO) IC7.44(CORE_CLKOUT) IC8.10(CLKOUT) IC8.29(DBG1) IC8.30(DBG0) IC8.44(CORE_CLKOUT) IC9.10(CLKOUT) IC9.29(DBG1) IC9.30(DBG0) IC9.44(CORE_CLKOUT) IC10.10(CLKOUT) IC10.29(DBG1) IC10.30(DBG0) IC10.44(CORE_CLKOUT) IC11.10(CLKOUT) IC11.29(DBG1) IC11.30(DBG0) IC11.35(CONFIG_NO) IC11.36(CONFIG_PO) IC11.44(CORE_CLKOUT) IC12.10(CLKOUT) IC12.29(DBG1) IC12.30(DBG0) IC12.44(CORE_CLKOUT) IC13.10(CLKOUT) IC13.29(DBG1) IC13.30(DBG0) IC13.44(CORE_CLKOUT) IC14.10(CLKOUT) IC14.29(DBG1) IC14.30(DBG0) IC14.44(CORE_CLKOUT) IC15.10(CLKOUT) IC15.29(DBG1) IC15.30(DBG0) IC15.35(CONFIG_NO) IC15.36(CONFIG_PO) IC15.44(CORE_CLKOUT) IC20.3(!MR!) IC20.4(MRC) IC21.3(!MR!) IC21.4(MRC) IC22.3(!MR!) IC22.4(MRC)

## Sheet 4 of 4: ASIC decoupling
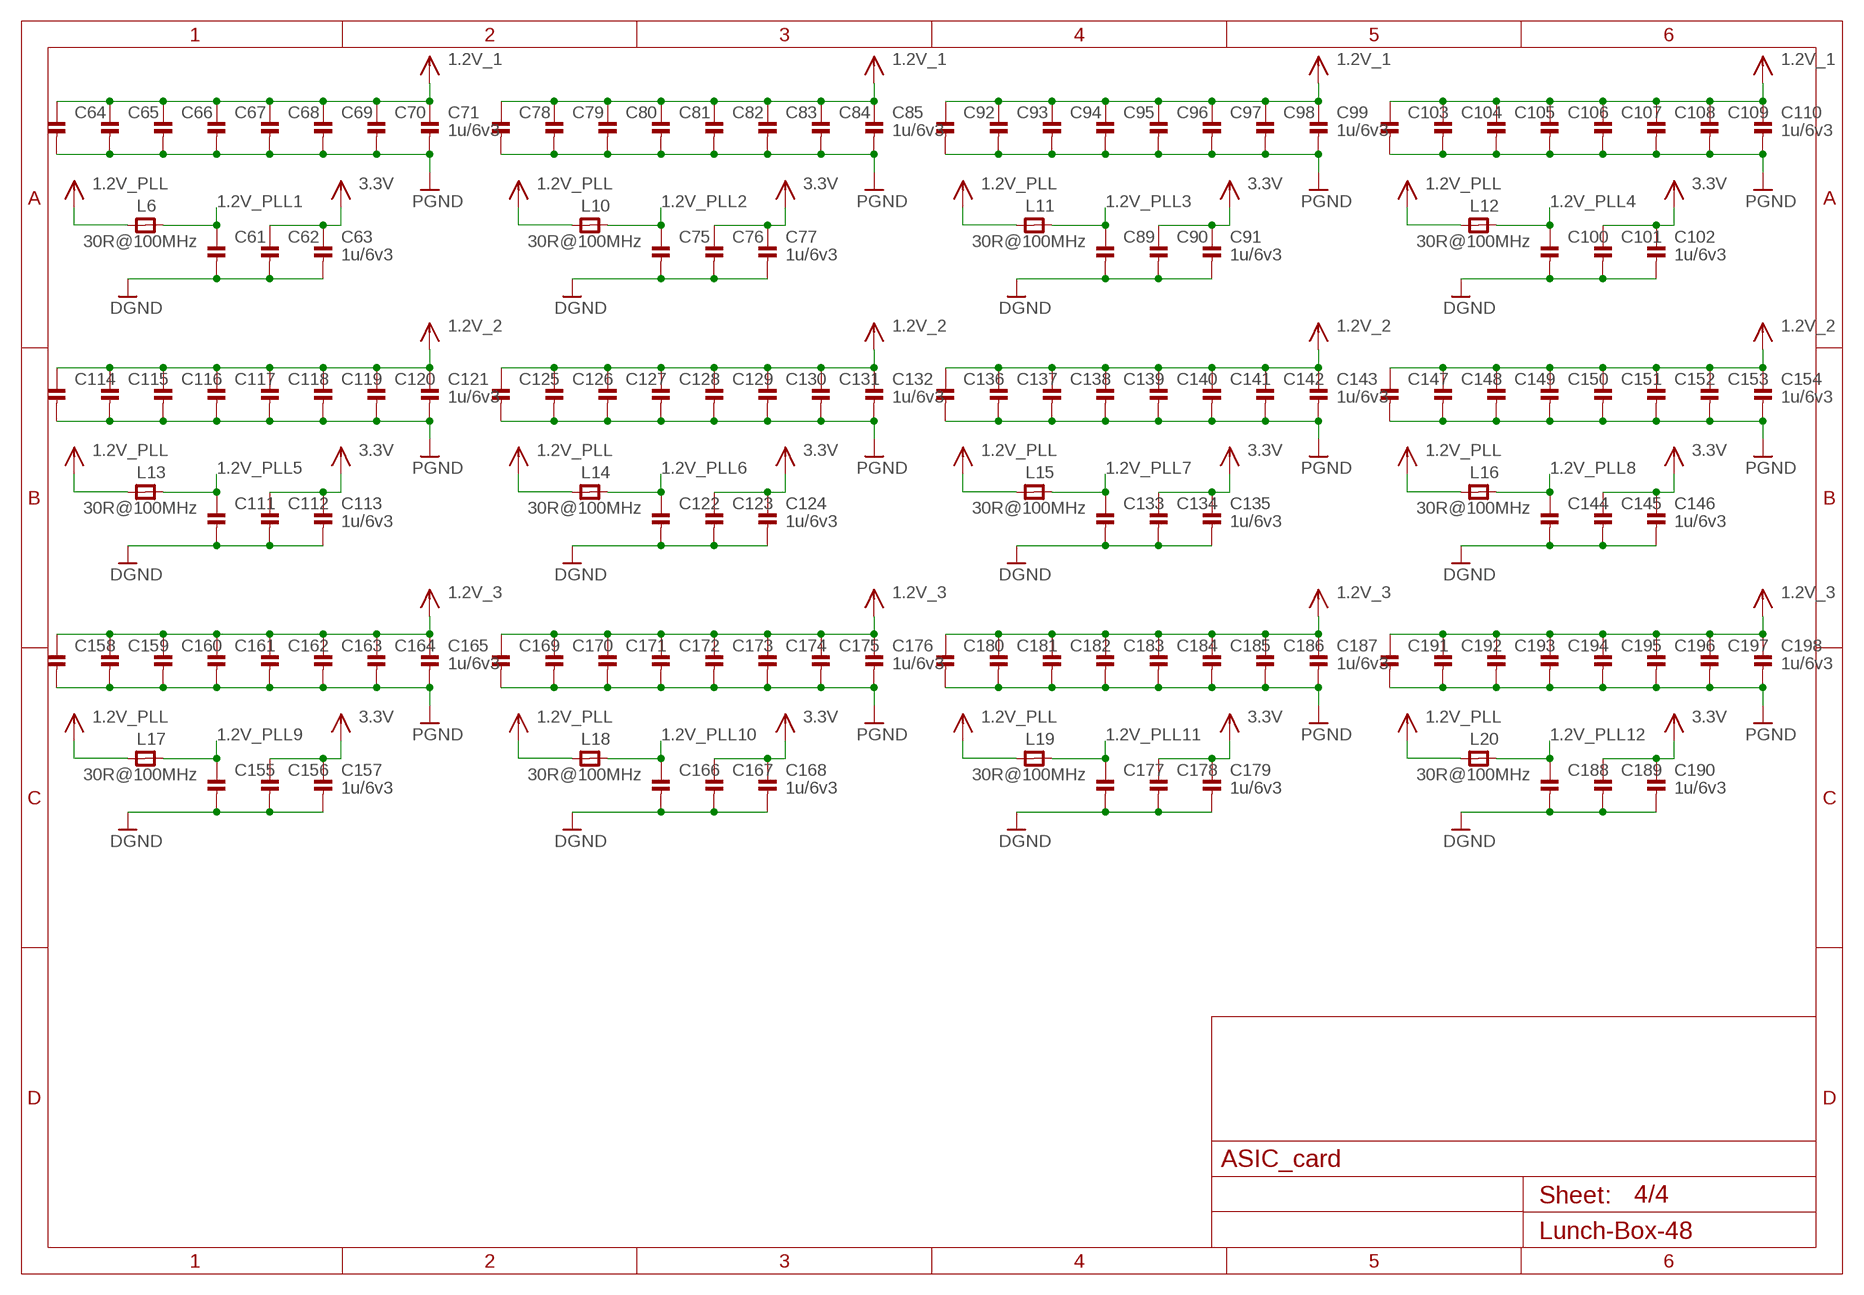
[diagram p3: schematic, sheet 4]

### Parts
C61  1u/6v3  C0402  [0402]
C62  1u/6v3  C0402  [0402]
C63  1u/6v3  C0402  [0402]
C64  1u/6v3  C0402  [0402]
C65  1u/6v3  C0402  [0402]
C66  1u/6v3  C0402  [0402]
C67  1u/6v3  C0402  [0402]
C68  1u/6v3  C0402  [0402]
C69  1u/6v3  C0402  [0402]
C70  1u/6v3  C0402  [0402]
C71  1u/6v3  C0402  [0402]
C75  1u/6v3  C0402  [0402]
C76  1u/6v3  C0402  [0402]
C77  1u/6v3  C0402  [0402]
C78  1u/6v3  C0402  [0402]
C79  1u/6v3  C0402  [0402]
C80  1u/6v3  C0402  [0402]
C81  1u/6v3  C0402  [0402]
C82  1u/6v3  C0402  [0402]
C83  1u/6v3  C0402  [0402]
C84  1u/6v3  C0402  [0402]
C85  1u/6v3  C0402  [0402]
C89  1u/6v3  C0402  [0402]
C90  1u/6v3  C0402  [0402]
C91  1u/6v3  C0402  [0402]
C92  1u/6v3  C0402  [0402]
C93  1u/6v3  C0402  [0402]
C94  1u/6v3  C0402  [0402]
C95  1u/6v3  C0402  [0402]
C96  1u/6v3  C0402  [0402]
C97  1u/6v3  C0402  [0402]
C98  1u/6v3  C0402  [0402]
C99  1u/6v3  C0402  [0402]
C100  1u/6v3  C0402  [0402]
C101  1u/6v3  C0402  [0402]
C102  1u/6v3  C0402  [0402]
C103  1u/6v3  C0402  [0402]
C104  1u/6v3  C0402  [0402]
C105  1u/6v3  C0402  [0402]
C106  1u/6v3  C0402  [0402]
C107  1u/6v3  C0402  [0402]
C108  1u/6v3  C0402  [0402]
C109  1u/6v3  C0402  [0402]
C110  1u/6v3  C0402  [0402]
C111  1u/6v3  C0402  [0402]
C112  1u/6v3  C0402  [0402]
C113  1u/6v3  C0402  [0402]
C114  1u/6v3  C0402  [0402]
C115  1u/6v3  C0402  [0402]
C116  1u/6v3  C0402  [0402]
C117  1u/6v3  C0402  [0402]
C118  1u/6v3  C0402  [0402]
C119  1u/6v3  C0402  [0402]
C120  1u/6v3  C0402  [0402]
C121  1u/6v3  C0402  [0402]
C122  1u/6v3  C0402  [0402]
C123  1u/6v3  C0402  [0402]
C124  1u/6v3  C0402  [0402]
C125  1u/6v3  C0402  [0402]
C126  1u/6v3  C0402  [0402]
C127  1u/6v3  C0402  [0402]
C128  1u/6v3  C0402  [0402]
C129  1u/6v3  C0402  [0402]
C130  1u/6v3  C0402  [0402]
C131  1u/6v3  C0402  [0402]
C132  1u/6v3  C0402  [0402]
C133  1u/6v3  C0402  [0402]
C134  1u/6v3  C0402  [0402]
C135  1u/6v3  C0402  [0402]
C136  1u/6v3  C0402  [0402]
C137  1u/6v3  C0402  [0402]
C138  1u/6v3  C0402  [0402]
C139  1u/6v3  C0402  [0402]
C140  1u/6v3  C0402  [0402]
C141  1u/6v3  C0402  [0402]
C142  1u/6v3  C0402  [0402]
C143  1u/6v3  C0402  [0402]
C144  1u/6v3  C0402  [0402]
C145  1u/6v3  C0402  [0402]
C146  1u/6v3  C0402  [0402]
C147  1u/6v3  C0402  [0402]
C148  1u/6v3  C0402  [0402]
C149  1u/6v3  C0402  [0402]
C150  1u/6v3  C0402  [0402]
C151  1u/6v3  C0402  [0402]
C152  1u/6v3  C0402  [0402]
C153  1u/6v3  C0402  [0402]
C154  1u/6v3  C0402  [0402]
C155  1u/6v3  C0402  [0402]
C156  1u/6v3  C0402  [0402]
C157  1u/6v3  C0402  [0402]
C158  1u/6v3  C0402  [0402]
C159  1u/6v3  C0402  [0402]
C160  1u/6v3  C0402  [0402]
C161  1u/6v3  C0402  [0402]
C162  1u/6v3  C0402  [0402]
C163  1u/6v3  C0402  [0402]
C164  1u/6v3  C0402  [0402]
C165  1u/6v3  C0402  [0402]
C166  1u/6v3  C0402  [0402]
C167  1u/6v3  C0402  [0402]
C168  1u/6v3  C0402  [0402]
C169  1u/6v3  C0402  [0402]
C170  1u/6v3  C0402  [0402]
C171  1u/6v3  C0402  [0402]
C172  1u/6v3  C0402  [0402]
C173  1u/6v3  C0402  [0402]
C174  1u/6v3  C0402  [0402]
C175  1u/6v3  C0402  [0402]
C176  1u/6v3  C0402  [0402]
C177  1u/6v3  C0402  [0402]
C178  1u/6v3  C0402  [0402]
C179  1u/6v3  C0402  [0402]
C180  1u/6v3  C0402  [0402]
C181  1u/6v3  C0402  [0402]
C182  1u/6v3  C0402  [0402]
C183  1u/6v3  C0402  [0402]
C184  1u/6v3  C0402  [0402]
C185  1u/6v3  C0402  [0402]
C186  1u/6v3  C0402  [0402]
C187  1u/6v3  C0402  [0402]
C188  1u/6v3  C0402  [0402]
C189  1u/6v3  C0402  [0402]
C190  1u/6v3  C0402  [0402]
C191  1u/6v3  C0402  [0402]
C192  1u/6v3  C0402  [0402]
C193  1u/6v3  C0402  [0402]
C194  1u/6v3  C0402  [0402]
C195  1u/6v3  C0402  [0402]
C196  1u/6v3  C0402  [0402]
C197  1u/6v3  C0402  [0402]
C198  1u/6v3  C0402  [0402]
L6  30R@100MHz  FERRITE0603  [0603]
L10  30R@100MHz  FERRITE0603  [0603]
L11  30R@100MHz  FERRITE0603  [0603]
L12  30R@100MHz  FERRITE0603  [0603]
L13  30R@100MHz  FERRITE0603  [0603]
L14  30R@100MHz  FERRITE0603  [0603]
L15  30R@100MHz  FERRITE0603  [0603]
L16  30R@100MHz  FERRITE0603  [0603]
L17  30R@100MHz  FERRITE0603  [0603]
L18  30R@100MHz  FERRITE0603  [0603]
L19  30R@100MHz  FERRITE0603  [0603]
L20  30R@100MHz  FERRITE0603  [0603]

### Nets
1.2V_1: C64.1 C65.1 C66.1 C67.1 C68.1 C69.1 C70.1 C71.1 C78.1 C79.1 C80.1 C81.1 C82.1 C83.1 C84.1 C85.1 C92.1 C93.1 C94.1 C95.1 C96.1 C97.1 C98.1 C99.1 C103.1 C104.1 C105.1 C106.1 C107.1 C108.1 C109.1 C110.1 ; also sheet 2,3
1.2V_2: C114.1 C115.1 C116.1 C117.1 C118.1 C119.1 C120.1 C121.1 C125.1 C126.1 C127.1 C128.1 C129.1 C130.1 C131.1 C132.1 C136.1 C137.1 C138.1 C139.1 C140.1 C141.1 C142.1 C143.1 C147.1 C148.1 C149.1 C150.1 C151.1 C152.1 C153.1 C154.1 ; also sheet 2,3
1.2V_3: C158.1 C159.1 C160.1 C161.1 C162.1 C163.1 C164.1 C165.1 C169.1 C170.1 C171.1 C172.1 C173.1 C174.1 C175.1 C176.1 C180.1 C181.1 C182.1 C183.1 C184.1 C185.1 C186.1 C187.1 C191.1 C192.1 C193.1 C194.1 C195.1 C196.1 C197.1 C198.1 ; also sheet 2,3
1.2V_PLL: L6.1 L10.1 L11.1 L12.1 L13.1 L14.1 L15.1 L16.1 L17.1 L18.1 L19.1 L20.1 ; also sheet 2
1.2V_PLL1: C61.1 L6.2 ; also sheet 3
1.2V_PLL2: C75.1 L10.2 ; also sheet 3
1.2V_PLL3: C89.1 L11.2 ; also sheet 3
1.2V_PLL4: C100.1 L12.2 ; also sheet 3
1.2V_PLL5: C111.1 L13.2 ; also sheet 3
1.2V_PLL6: C122.1 L14.2 ; also sheet 3
1.2V_PLL7: C133.1 L15.2 ; also sheet 3
1.2V_PLL8: C144.1 L16.2 ; also sheet 3
1.2V_PLL9: C155.1 L17.2 ; also sheet 3
1.2V_PLL10: C166.1 L18.2 ; also sheet 3
1.2V_PLL11: C177.1 L19.2 ; also sheet 3
1.2V_PLL12: C188.1 L20.2 ; also sheet 3
3.3V: C62.1 C63.1 C76.1 C77.1 C90.1 C91.1 C101.1 C102.1 C112.1 C113.1 C123.1 C124.1 C134.1 C135.1 C145.1 C146.1 C156.1 C157.1 C167.1 C168.1 C178.1 C179.1 C189.1 C190.1 ; also sheet 1,2,3
DGND: C61.2 C62.2 C63.2 C75.2 C76.2 C77.2 C89.2 C90.2 C91.2 C100.2 C101.2 C102.2 C111.2 C112.2 C113.2 C122.2 C123.2 C124.2 C133.2 C134.2 C135.2 C144.2 C145.2 C146.2 C155.2 C156.2 C157.2 C166.2 C167.2 C168.2 C177.2 C178.2 C179.2 C188.2 C189.2 C190.2 ; also sheet 1,2,3
PGND: C64.2 C65.2 C66.2 C67.2 C68.2 C69.2 C70.2 C71.2 C78.2 C79.2 C80.2 C81.2 C82.2 C83.2 C84.2 C85.2 C92.2 C93.2 C94.2 C95.2 C96.2 C97.2 C98.2 C99.2 C103.2 C104.2 C105.2 C106.2 C107.2 C108.2 C109.2 C110.2 C114.2 C115.2 C116.2 C117.2 C118.2 C119.2 C120.2 C121.2 C125.2 C126.2 C127.2 C128.2 C129.2 C130.2 C131.2 C132.2 C136.2 C137.2 C138.2 C139.2 C140.2 C141.2 C142.2 C143.2 C147.2 C148.2 C149.2 C150.2 C151.2 C152.2 C153.2 C154.2 C158.2 C159.2 C160.2 C161.2 C162.2 C163.2 C164.2 C165.2 C169.2 C170.2 C171.2 C172.2 C173.2 C174.2 C175.2 C176.2 C180.2 C181.2 C182.2 C183.2 C184.2 C185.2 C186.2 C187.2 C191.2 C192.2 C193.2 C194.2 C195.2 C196.2 C197.2 C198.2 ; also sheet 1,2,3

## Library data of the parts
C1-C4 C14-C17 C27-C30 C86-C88 = LunchBox48_ASIC_board:C_POL
C5-C13 C18-C26 C31-C85 C89-C201 = LunchBox48_ASIC_board:C: Capacitor based on microbulder lib
FID1-FID3 = LunchBox48_ASIC_board:FIDUCIAL: 1mm round fiducial
HS1-HS3 = LunchBox48_ASIC_board:HALFBRICK_HEATSINK: Wakefield 518-95AB Halfbrick heatsink
IC1-IC3 = LunchBox48_ASIC_board:ISL6545: ISL6545 Intersil, Buck Controller
IC4-IC15 = LunchBox48_ASIC_board:A3256-Q48: Avalon ASIC chip A3256Q48
IC16 = LunchBox48_ASIC_board:AOZ1050PI: Alpha and Omega semi AOZ1050PI Buck reg 2A
IC17 = LunchBox48_ASIC_board:AP7165-SPG-13: DIODES inc. AP7165-SPG-13 1,2V 600mA LDO
IC18 = LunchBox48_ASIC_board:NB3N551DG: 1:4 clock fanout buffer
IC19 = LunchBox48_ASIC_board:PI49FCT3807C: 1:10 clk buffer
IC20-IC22 = LunchBox48_ASIC_board:STM6780TWB6F
IC23-IC28 = LunchBox48_ASIC_board:74LVC2G17GV: NXP 74LVC2G17GV Dual Schmitt trigger buffer
K1 = LunchBox48_ASIC_board:PCI-E_CARDEDGE: PCI-e 16x card edge
L1-L3 = LunchBox48_ASIC_board:B82559A0142A013: Epcos B82559A0142A013 22A 1,4uH 1,5mOhm inductor
L4 = LunchBox48_ASIC_board:SRU1048-6R8Y: Bourns SRU1048-6R8Y inductor 6.8uH 4.1A 13.6mOhm
L5-L20 = LunchBox48_ASIC_board:FERRITE: SMD ferrite bead
R1-R46 = LunchBox48_ASIC_board:R: Resistors based on Microbuilder lib
T1-T3 = LunchBox48_ASIC_board:AON9673A: Dual asymetric nmosfet AON9673A
VIA1-VIA3 = LunchBox48_ASIC_board:VIA
X1 = LunchBox48_ASIC_board:CB3LV-3C-32M0000: Xtal oscillator 32MHz cmos 3,3V